# Altium schematic sheet uc2A.SchDoc: Microcontroller 2 (Part A)
size A4; Author: Marcel Hellwig; Organization: Hamburg Bit-Bots; Address1: Vogt-Kölln-Str. 30; Address2: 22527 Hamburg; Address3: Germany; Address4: www.bit-bots.de; DocumentNumber: 7; Revision: A; SheetNumber: 7; SheetTotal: 16; EMail: info@bit-bots.de
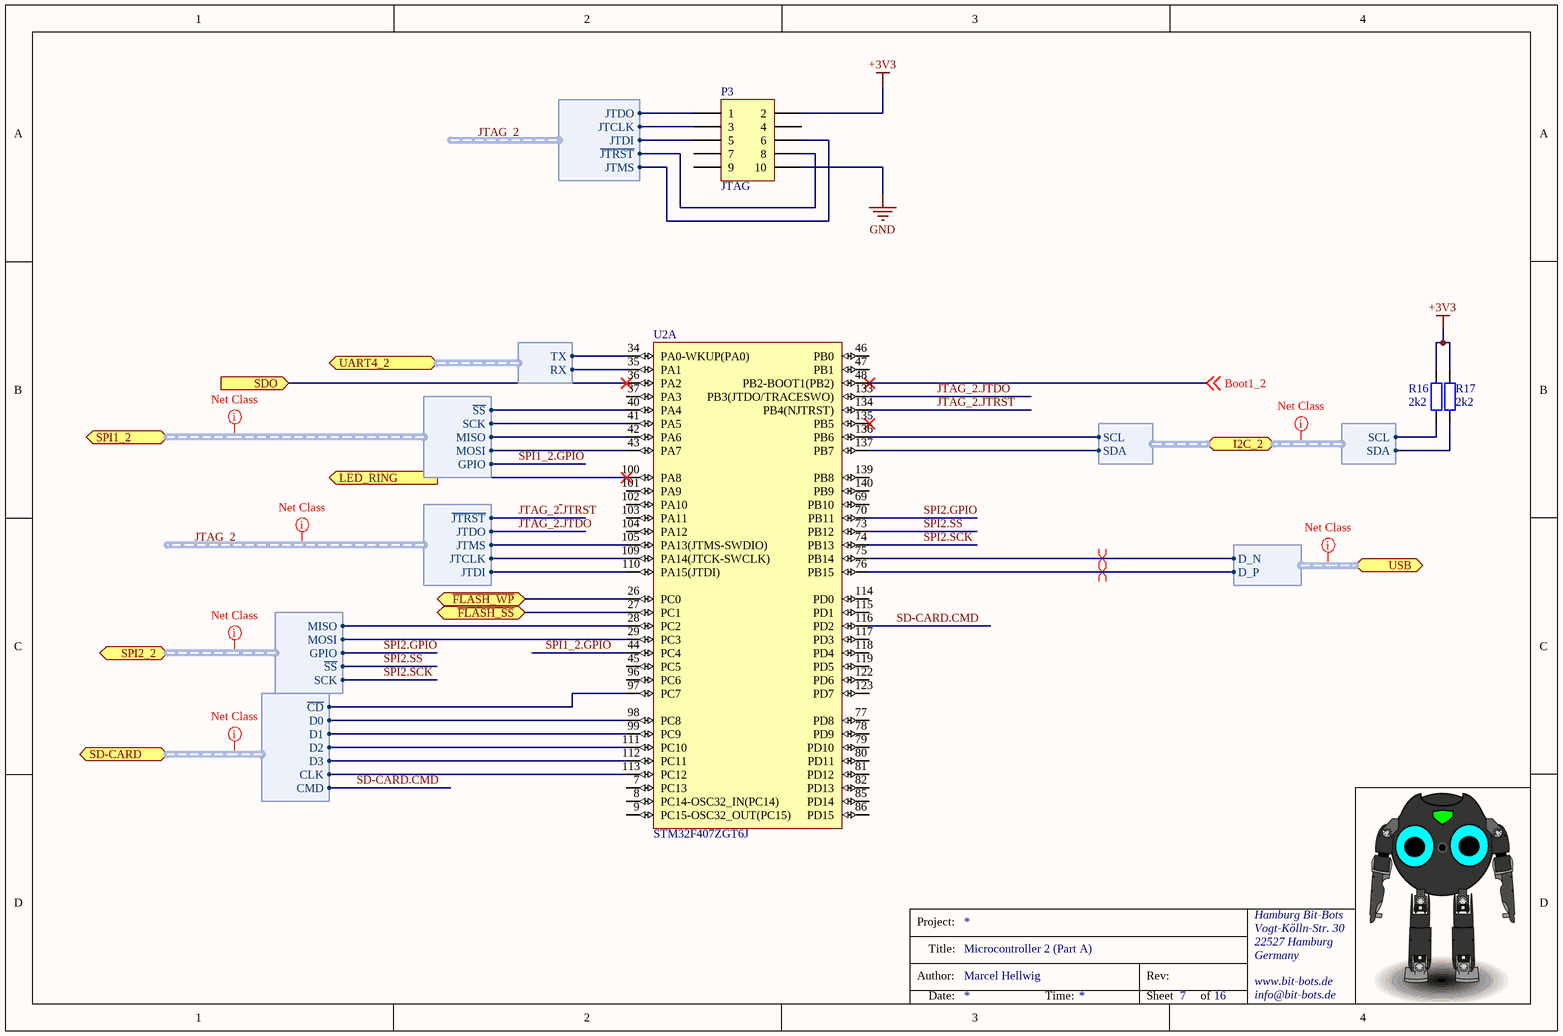
[diagram p0: uc2A.SchDoc]

## Parts
P3  JTAG  [HDR2X5]  (no BOM)
R16  2k2  [R2012]
R17  2k2  [R2012]
U2  STM32F407ZGT6J  [STM-LQFP144_M]  (part A of 3)

## Ports
I2C_2 (harness I²C), LED_RING (out), SD-CARD (harness SD-Card), SDO (in), SPI1_2 (harness SPI), SPI2_2 (harness SPI), UART4_2 (harness UART), USB (harness USB), ~{FLASH_SS} (bidir), ~{FLASH_WP} (bidir)

## Harnesses
SPI: ~{SS}, SCK, MISO, MOSI, GPIO
USB: D_N, D_P
JTAG: ~{JTRST}, JTCLK, JTDI, JTDO, JTMS
I²C: SCL, SDA
UART: TX, RX
SD-Card: D0, D1, D2, D3, CLK, CMD, ~{CD}
SPI: ~{SS}, MISO, MOSI, SCK, GPIO

## Nets
+3V3: P3.2 R16.1 R17.2
GND: P3.10
~{FLASH_SS}: U2.27(PC1) ; port ~{FLASH_SS}
~{FLASH_WP}: U2.26(PC0) ; port ~{FLASH_WP}
Boot1_2: U2.48(PB2-BOOT1(PB2)) ; off-sheet Boot1_2
JTAG_2~{.}JTRST: P3.8 U2.134(PB4(NJTRST)) ; harness JTAG.~{JTRST}
JTAG_2.JTCLK: P3.3 U2.109(PA14(JTCK-SWCLK)) ; harness JTAG.JTCLK
JTAG_2.JTDI: P3.5 U2.110(PA15(JTDI)) ; harness JTAG.JTDI
JTAG_2.JTDO: P3.1 U2.133(PB3(JTDO/TRACESWO)) ; harness JTAG.JTDO
JTAG_2.JTMS: P3.6 U2.105(PA13(JTMS-SWDIO)) ; harness JTAG.JTMS
LED_RING: U2.100(PA8) ; port LED_RING
SD-CARD.CMD: U2.116(PD2) ; port SD-CARD.CMD
SDO: U2.36(PA2) ; port SDO
SPI1_2.GPIO: U2.44(PC4) ; port SPI1_2.GPIO
SPI2~{.}SS: U2.73(PB12) ; port SPI2_2.~{SS}
SPI2.GPIO: U2.70(PB11) ; port SPI2_2.GPIO
SPI2.SCK: U2.74(PB13) ; port SPI2_2.SCK
NetR16_2: R16.2 U2.136(PB6) ; port I2C_2.SCL
NetR17_1: R17.1 U2.137(PB7) ; port I2C_2.SDA
NetU2_28: U2.28(PC2) ; port SPI2_2.MISO
NetU2_29: U2.29(PC3) ; port SPI2_2.MOSI
NetU2_34: U2.34(PA0-WKUP(PA0)) ; port UART4_2.TX
NetU2_35: U2.35(PA1) ; port UART4_2.RX
NetU2_40: U2.40(PA4) ; port SPI1_2.~{SS}
NetU2_41: U2.41(PA5) ; port SPI1_2.SCK
NetU2_42: U2.42(PA6) ; port SPI1_2.MISO
NetU2_43: U2.43(PA7) ; port SPI1_2.MOSI
NetU2_75: U2.75(PB14) ; port USB.D_N
NetU2_76: U2.76(PB15) ; port USB.D_P
NetU2_97: U2.97(PC7) ; port SD-CARD.~{CD}
NetU2_98: U2.98(PC8) ; port SD-CARD.D0
NetU2_99: U2.99(PC9) ; port SD-CARD.D1
NetU2_111: U2.111(PC10) ; port SD-CARD.D2
NetU2_112: U2.112(PC11) ; port SD-CARD.D3
NetU2_113: U2.113(PC12) ; port SD-CARD.CLK

Not connected (* = marked no-connect by the designer): P3 4 7 9; U2 7(PC13) 8(PC14-OSC32_IN(PC14)) 9(PC15-OSC32_OUT(PC15)) 37(PA3) 45(PC5) 46(PB0) 47(PB1) 69(PB10) 77(PD8) 78(PD9) 79(PD10) 80(PD11) 81(PD12) 82(PD13) 85(PD14) 86(PD15) 96(PC6) 101(PA9) 102(PA10) 103(PA11) 104(PA12) 114(PD0) 115(PD1) 117(PD3) 118(PD4) 119(PD5) 122(PD6) 123(PD7) 135(PB5)* 139(PB8) 140(PB9)

## Layout directives
net class SPI; net class SPI1: (no net found under the mark)
differential pair: NetU2_75, NetU2_76
net class USB: (no net found under the mark)
net class JTAG: (no net found under the mark)
net class I2C: (no net found under the mark)
net class SDCARD: (no net found under the mark)
net class SPI; net class SPI2: (no net found under the mark)

## Notes on the sheet
- Project:
- Author:
- Title:
- Rev:
- Date:
- Time:
- Sheet
- of

## Library data of the parts
P3 = Header 5X2: Header, 5-Pin, Dual row; LatestRevisionDate: 17-Jul-2002; LatestRevisionNote: Re-released for DXP Platform.; Publisher: Altium Limited
R16 R17 = Res2: Resistor; Manufacturer: MULTICOMP; Manufacturer Part Number: MCMR08X2201FTL; Produktpalette: Baureihe MCMR; Widerstand: 2.2; Nennleistung: 125; Widerstandstoleranz: ±1%; Bauform: 0805 [Metrisch 2012]; Widerstandselement: Keramik; Temperaturkoeffizient: ±100; Nennspannung: 150; Verpackung: Gurtabschnitt; SVHC: No SVHC (17-Dec-2014); Widerstandsmontage: Oberflächenmontage<!--FANDB--><div class="features-and-benefits-container"></div>; Published: 8-Jun-2000; LatestRevisionDate: 17-Jul-2002; LatestRevisionNote: Re-released for DXP Platform.; PackageReference: AXIAL-0.4; Publisher: Altium Limited; PackageDescription: Axial Device, Thru-Hole; 2 Leads; 0.4 in Pin Spacing; Value: 2k2; Supplier 1: Farnell; Supplier Part Number 1: 2073690; RoHS: YES; Stock 1: 38600; Pricing 1: 100=0,014, 500=0,011, 1000=0,01 (EUR); MSL: -; ComponentLink1URL: http://www.farnell.com/datasheets/1716708.pdf; ComponentLink1Description: http://www.farnell.com/datasheets/1716708.pdf
U2 = CMP-0243-00063-2: ARM Cortex-M4 32-bit MCU+FPU, 210 DMIPS, 1024 kB Flash, 192 kB Internal RAM, 114 I/Os, 144-pin LQFP, -40 to 85 degC, Tray; Manufacturer: STMicroelectronics; I/Os (High Current): 114; D/A Converter: 2x12-bit; Internal RAM Size (kB): 192; Operating Frequency(F) (Processor speed) (MHz): 168; Supply Voltage(Vcc) max (V): 3.6; Supply Voltage(Vcc) min (V): 1.8; FLASH Size (Prog) (kB): 1024; ComponentLink3Description: Package Specification; PackageVersion: Rev. 4, 06/2013; PartNumber: STM32F407ZGT6J; ComponentLink3URL: http://www.st.com/st-web-ui/static/active/en/resource/technical/document/datasheet/DM00037051.pdf; PackageReference: LQFP144; ComponentLink2URL: http://www.st.com/st-web-ui/static/active/en/resource/technical/document/datasheet/DM00037051.pdf; ComponentLink2Description: Datasheet; ComponentLink1Description: Manufacturer URL; Mounting Technology: Surface Mount; Core: ARM Cortex-M4; PackageDescription: 144-Pin Low Profile Quad Flat Package, 20 x 20 mm Body, 0.5 mm Pitch; Packing: Tray; ComponentLink1URL: http://www.st.com/web/en/home.html; DatasheetVersion: Rev. 4; PartId: 1; Supplier 1: Farnell; Supplier Part Number 1: 2333299